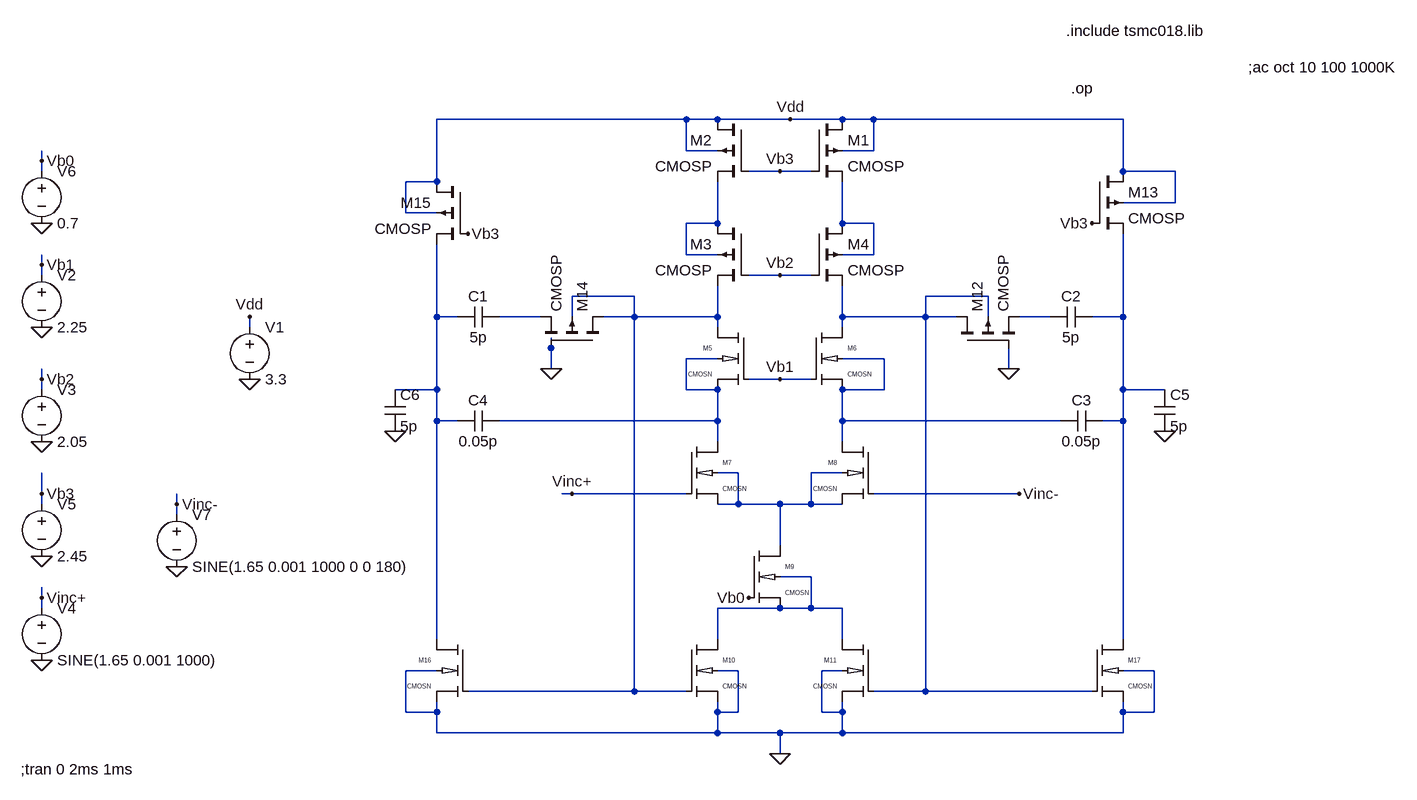
[diagram p0: schematic Diffamp.asc]
Diffamp.asc, the LTspice schematic file:
Version 4
SHEET 1 880 1156
WIRE -272 144 -656 144
WIRE -224 144 -272 144
WIRE -112 144 -224 144
WIRE -32 144 -112 144
WIRE 16 144 -32 144
WIRE 400 144 16 144
WIRE -272 192 -272 144
WIRE -224 192 -272 192
WIRE 16 192 16 144
WIRE 16 192 -32 192
WIRE -1264 208 -1264 192
WIRE -1264 224 -1264 208
WIRE -128 224 -176 224
WIRE -80 224 -128 224
WIRE 400 224 400 144
WIRE 480 224 400 224
WIRE -656 240 -656 144
WIRE -656 240 -704 240
WIRE 480 272 480 224
WIRE 480 272 400 272
WIRE -704 288 -704 240
WIRE -656 288 -704 288
WIRE -224 304 -224 240
WIRE -224 304 -272 304
WIRE -32 304 -32 240
WIRE 16 304 -32 304
WIRE -272 352 -272 304
WIRE -224 352 -272 352
WIRE 16 352 16 304
WIRE 16 352 -32 352
WIRE -1264 368 -1264 352
WIRE -1264 384 -1264 368
WIRE -128 384 -176 384
WIRE -80 384 -128 384
WIRE -352 416 -448 416
WIRE 192 416 96 416
WIRE -656 448 -656 336
WIRE -624 448 -656 448
WIRE -496 448 -560 448
WIRE -448 448 -448 416
WIRE -352 448 -352 416
WIRE -352 448 -400 448
WIRE -224 448 -224 400
WIRE -224 448 -352 448
WIRE -32 448 -32 400
WIRE 96 448 96 416
WIRE 96 448 -32 448
WIRE 144 448 96 448
WIRE 192 448 192 416
WIRE 288 448 240 448
WIRE 400 448 400 320
WIRE 400 448 352 448
WIRE -944 464 -944 448
WIRE -224 464 -224 448
WIRE -32 464 -32 448
WIRE -480 496 -480 480
WIRE -224 512 -272 512
WIRE 32 512 -32 512
WIRE -480 528 -480 496
WIRE 224 528 224 496
WIRE -1264 544 -1264 528
WIRE -128 544 -176 544
WIRE -80 544 -128 544
WIRE -1264 560 -1264 544
WIRE -656 560 -656 448
WIRE -656 560 -720 560
WIRE -272 560 -272 512
WIRE -224 560 -272 560
WIRE 32 560 32 512
WIRE 32 560 -32 560
WIRE 400 560 400 448
WIRE 464 560 400 560
WIRE -656 608 -656 560
WIRE -624 608 -656 608
WIRE -224 608 -224 560
WIRE -224 608 -560 608
WIRE -32 608 -32 560
WIRE 304 608 -32 608
WIRE 400 608 400 560
WIRE 400 608 368 608
WIRE -224 640 -224 608
WIRE -32 640 -32 608
WIRE -192 688 -224 688
WIRE -32 688 -80 688
WIRE -1264 720 -1264 688
WIRE -448 720 -464 720
WIRE -304 720 -448 720
WIRE -272 720 -304 720
WIRE 240 720 16 720
WIRE -1264 736 -1264 720
WIRE -1056 736 -1056 720
WIRE -192 736 -192 688
WIRE -192 736 -224 736
WIRE -128 736 -192 736
WIRE -80 736 -80 688
WIRE -80 736 -128 736
WIRE -32 736 -80 736
WIRE -1056 752 -1056 736
WIRE -128 800 -128 736
WIRE -80 848 -128 848
WIRE -1264 880 -1264 864
WIRE -1264 896 -1264 880
WIRE -128 896 -224 896
WIRE -80 896 -80 848
WIRE -80 896 -128 896
WIRE -32 896 -80 896
WIRE -656 944 -656 608
WIRE -224 944 -224 896
WIRE -32 944 -32 896
WIRE 400 944 400 608
WIRE -656 992 -704 992
WIRE -192 992 -224 992
WIRE -32 992 -64 992
WIRE 448 992 400 992
WIRE -352 1024 -352 448
WIRE -352 1024 -608 1024
WIRE -272 1024 -352 1024
WIRE 96 1024 96 448
WIRE 96 1024 16 1024
WIRE 352 1024 96 1024
WIRE -704 1056 -704 992
WIRE -656 1056 -656 1040
WIRE -656 1056 -704 1056
WIRE -224 1056 -224 1040
WIRE -192 1056 -192 992
WIRE -192 1056 -224 1056
WIRE -64 1056 -64 992
WIRE -32 1056 -32 1040
WIRE -32 1056 -64 1056
WIRE 400 1056 400 1040
WIRE 448 1056 448 992
WIRE 448 1056 400 1056
WIRE -656 1088 -656 1056
WIRE -224 1088 -224 1056
WIRE -224 1088 -656 1088
WIRE -128 1088 -224 1088
WIRE -32 1088 -32 1056
WIRE -32 1088 -128 1088
WIRE 400 1088 400 1056
WIRE 400 1088 -32 1088
WIRE -128 1120 -128 1088
FLAG -128 1120 0
FLAG 464 624 0
FLAG -480 528 0
FLAG 224 528 0
FLAG -944 544 0
FLAG -1264 464 0
FLAG -1264 640 0
FLAG -1264 816 0
FLAG -944 448 Vdd
FLAG -112 144 Vdd
FLAG -128 544 Vb1
FLAG -1264 368 Vb1
FLAG -128 384 Vb2
FLAG -1264 544 Vb2
FLAG -1264 720 Vb3
FLAG -128 224 Vb3
FLAG -1264 304 0
FLAG -1264 208 Vb0
FLAG -608 320 Vb3
FLAG 352 304 Vb3
FLAG -1264 976 0
FLAG -1264 880 Vinc+
FLAG -1056 832 0
FLAG -1056 736 Vinc-
FLAG -176 880 Vb0
FLAG -720 624 0
FLAG -448 720 Vinc+
FLAG 240 720 Vinc-
DATAFLAG -304 720 ""
SYMBOL cmosp -80 144 R0
SYMATTR InstName M1
SYMATTR SpiceModel ""
SYMATTR Value2 l=1.4u w=112u
SYMATTR SpiceLine ""
SYMATTR SpiceLine2 ""
SYMBOL cmosp -176 144 M0
SYMATTR InstName M2
SYMATTR SpiceModel ""
SYMATTR Value2 l=1.4u w=112u
SYMATTR SpiceLine ""
SYMATTR SpiceLine2 ""
SYMBOL cmosp -176 304 M0
SYMATTR InstName M3
SYMATTR SpiceModel ""
SYMATTR Value2 l=1.4u w=56u
SYMATTR SpiceLine ""
SYMATTR SpiceLine2 ""
SYMBOL cmosp -80 304 R0
SYMATTR InstName M4
SYMATTR SpiceModel ""
SYMATTR Value2 l=1.4u w=56u
SYMATTR SpiceLine ""
SYMATTR SpiceLine2 ""
SYMBOL cmosn -176 464 M0
SYMATTR InstName M5
SYMATTR SpiceModel ""
SYMATTR Value2 l=1.4u w=14u
SYMATTR SpiceLine ""
SYMATTR SpiceLine2 ""
SYMBOL cmosn -80 464 R0
SYMATTR InstName M6
SYMATTR SpiceModel ""
SYMATTR Value2 l=1.4u w=14u
SYMATTR SpiceLine ""
SYMATTR SpiceLine2 ""
SYMBOL cmosn -272 640 R0
SYMATTR InstName M7
SYMATTR SpiceModel ""
SYMATTR Value2 l=1.4u w=18.9u
SYMATTR SpiceLine ""
SYMATTR SpiceLine2 ""
SYMBOL cmosn 16 640 M0
SYMATTR InstName M8
SYMATTR SpiceModel ""
SYMATTR Value2 l=1.4u w=18.9u
SYMATTR SpiceLine ""
SYMATTR SpiceLine2 ""
SYMBOL cmosn -176 800 R0
SYMATTR InstName M9
SYMATTR SpiceModel ""
SYMATTR Value2 l=1.4u w=694.75u
SYMATTR SpiceLine ""
SYMATTR SpiceLine2 ""
SYMBOL cmosn -272 944 R0
SYMATTR InstName M10
SYMATTR SpiceModel ""
SYMATTR Value2 l=1.4u w=7.7u
SYMATTR SpiceLine ""
SYMATTR SpiceLine2 ""
SYMBOL cmosn 16 944 M0
SYMATTR InstName M11
SYMATTR SpiceModel ""
SYMATTR Value2 l=1.4u w=7.7u
SYMATTR SpiceLine ""
SYMATTR SpiceLine2 ""
SYMBOL cmosp 144 496 R270
SYMATTR InstName M12
SYMATTR SpiceModel ""
SYMATTR Value2 l=13.3u w=210u
SYMATTR SpiceLine ""
SYMATTR SpiceLine2 ""
SYMBOL cmosp 352 224 R0
SYMATTR InstName M13
SYMATTR SpiceModel ""
SYMATTR Value2 l=1.4u w=287u
SYMATTR SpiceLine ""
SYMATTR SpiceLine2 ""
SYMBOL cmosp -400 496 M270
SYMATTR InstName M14
SYMATTR SpiceModel ""
SYMATTR Value2 l=13.3u w=210u
SYMATTR SpiceLine ""
SYMATTR SpiceLine2 ""
SYMBOL cmosp -608 240 M0
SYMATTR InstName M15
SYMATTR SpiceModel ""
SYMATTR Value2 l=1.4u w=287u
SYMATTR SpiceLine ""
SYMATTR SpiceLine2 ""
SYMBOL cmosn -608 944 M0
SYMATTR InstName M16
SYMATTR SpiceModel ""
SYMATTR Value2 l=1.4u w=5.95u
SYMATTR SpiceLine ""
SYMATTR SpiceLine2 ""
SYMBOL cmosn 352 944 R0
SYMATTR InstName M17
SYMATTR SpiceModel ""
SYMATTR Value2 l=1.4u w=5.95u
SYMATTR SpiceLine ""
SYMATTR SpiceLine2 ""
SYMBOL cap -560 432 R90
WINDOW 0 0 32 VBottom 2
WINDOW 3 32 32 VTop 2
SYMATTR InstName C1
SYMATTR Value 5p
SYMATTR SpiceLine ""
SYMBOL cap 352 432 R90
WINDOW 0 0 32 VBottom 2
WINDOW 3 32 32 VTop 2
SYMATTR InstName C2
SYMATTR Value 5p
SYMATTR SpiceLine ""
SYMBOL cap 368 592 R90
WINDOW 0 0 32 VBottom 2
WINDOW 3 32 32 VTop 2
SYMATTR InstName C3
SYMATTR Value 0.05p
SYMATTR SpiceLine ""
SYMBOL cap -560 592 R90
WINDOW 0 0 32 VBottom 2
WINDOW 3 32 32 VTop 2
SYMATTR InstName C4
SYMATTR Value 0.05p
SYMATTR SpiceLine ""
SYMBOL cap 448 560 R0
SYMATTR InstName C5
SYMATTR Value 5p
SYMATTR SpiceLine ""
SYMBOL voltage -944 448 R0
WINDOW 123 0 0 Left 2
WINDOW 39 0 0 Left 2
SYMATTR Value2 ""
SYMATTR SpiceLine ""
SYMATTR InstName V1
SYMATTR Value 3.3
SYMBOL voltage -1264 368 R0
WINDOW 123 0 0 Left 2
WINDOW 39 0 0 Left 2
SYMATTR Value2 ""
SYMATTR SpiceLine ""
SYMATTR InstName V2
SYMATTR Value 2.25
SYMBOL voltage -1264 544 R0
WINDOW 123 0 0 Left 2
WINDOW 39 0 0 Left 2
SYMATTR Value2 ""
SYMATTR SpiceLine ""
SYMATTR InstName V3
SYMATTR Value 2.05
SYMBOL voltage -1264 720 R0
WINDOW 123 0 0 Left 2
WINDOW 39 0 0 Left 2
SYMATTR Value2 ""
SYMATTR SpiceLine ""
SYMATTR InstName V5
SYMATTR Value 2.45
SYMBOL voltage -1264 208 R0
WINDOW 123 0 0 Left 2
WINDOW 39 0 0 Left 2
SYMATTR Value2 ""
SYMATTR SpiceLine ""
SYMATTR InstName V6
SYMATTR Value 0.7
SYMBOL voltage -1264 880 R0
WINDOW 123 0 0 Left 2
WINDOW 39 0 0 Left 2
SYMATTR Value2 ""
SYMATTR SpiceLine ""
SYMATTR InstName V4
SYMATTR Value SINE(1.65 0.001 1000)
SYMBOL voltage -1056 736 R0
WINDOW 123 0 0 Left 2
WINDOW 39 0 0 Left 2
SYMATTR Value2 ""
SYMATTR SpiceLine ""
SYMATTR InstName V7
SYMATTR Value SINE(1.65 0.001 1000 0 0 180)
SYMBOL cap -736 560 R0
SYMATTR InstName C6
SYMATTR Value 5p
SYMATTR SpiceLine ""
TEXT 312 8 Left 2 !.include tsmc018.lib
TEXT 320 96 Left 2 !.op
TEXT 592 64 Left 2 !;ac oct 10 100 1000K
TEXT -1296 1144 Left 2 !;tran 0 2ms 1ms

The netlist it stands for:
* Diffamp.asc
M1 Vdd Vb3 N002 Vdd CMOSP l=1.4u w=112u
M2 Vdd Vb3 N001 Vdd CMOSP l=1.4u w=112u
M3 N001 Vb2 N003 N001 CMOSP l=1.4u w=56u
M4 N002 Vb2 N004 N002 CMOSP l=1.4u w=56u
M5 N003 Vb1 N009 N009 CMOSN l=1.4u w=14u
M6 N004 Vb1 N010 N010 CMOSN l=1.4u w=14u
M7 N009 Vinc+ N011 N011 CMOSN l=1.4u w=18.9u
M8 N010 Vinc- N011 N011 CMOSN l=1.4u w=18.9u
M9 N011 Vb0 N012 N012 CMOSN l=1.4u w=694.75u
M10 N012 N003 0 0 CMOSN l=1.4u w=7.7u
M11 N012 N004 0 0 CMOSN l=1.4u w=7.7u
M12 N004 0 N007 N004 CMOSP l=13.3u w=210u
M13 Vdd Vb3 N008 Vdd CMOSP l=1.4u w=287u
M14 N003 0 N006 N003 CMOSP l=13.3u w=210u
M15 Vdd Vb3 N005 Vdd CMOSP l=1.4u w=287u
M16 N005 N003 0 0 CMOSN l=1.4u w=5.95u
M17 N008 N004 0 0 CMOSN l=1.4u w=5.95u
C1 N006 N005 5p
C2 N008 N007 5p
C3 N008 N010 0.05p
C4 N009 N005 0.05p
C5 N008 0 5p
V1 Vdd 0 3.3
V2 Vb1 0 2.25
V3 Vb2 0 2.05
V5 Vb3 0 2.45
V6 Vb0 0 0.7
V4 Vinc+ 0 SINE(1.65 0.001 1000)
V7 Vinc- 0 SINE(1.65 0.001 1000 0 0 180)
C6 N005 0 5p
.model NMOS NMOS
.model PMOS PMOS
.lib standard.mos
.include tsmc018.lib
.op
;ac oct 10 100 1000K
;tran 0 2ms 1ms
.lib tsmc018.lib
.backanno
.end